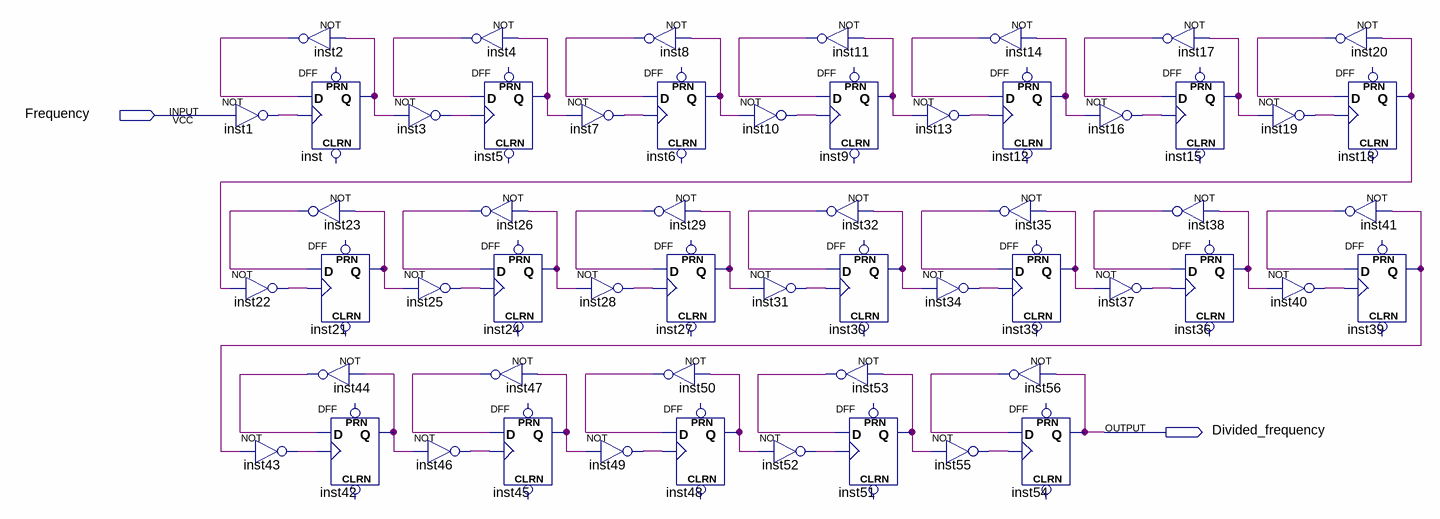
[diagram p0: schematic sheet]
// Quartus schematic Frequency_divider.bdf as structural Verilog: 57 symbols, 2 pins
module Frequency_divider (
  input  Frequency,
  output Divided_frequency
);

  wire inst1_out, inst2_out, inst3_out, inst4_out, inst5_q, inst6_q, inst7_out, inst8_out, inst9_q,
       inst10_out, inst11_out, inst12_q, inst13_out, inst14_out, inst15_q, inst16_out, inst17_out, inst18_q,
       inst19_out, inst20_out, inst21_q, inst22_out, inst23_out, inst24_q, inst25_out, inst26_out, inst27_q,
       inst28_out, inst29_out, inst30_q, inst31_out, inst32_out, inst33_q, inst34_out, inst35_out, inst36_q,
       inst37_out, inst38_out, inst39_q, inst40_out, inst41_out, inst42_q, inst43_out, inst44_out, inst45_q,
       inst46_out, inst47_out, inst48_q, inst49_out, inst50_out, inst51_q, inst52_out, inst53_out,
       inst55_out, inst56_out, inst_q;

  not inst1 (inst1_out, Frequency);
  not inst22 (inst22_out, inst18_q);
  not inst43 (inst43_out, inst39_q);
  not inst2 (inst2_out, inst_q);
  DFF inst (.CLK(inst1_out), .D(inst2_out), .Q(inst_q));  // open: CLRN, PRN
  not inst23 (inst23_out, inst21_q);
  DFF inst21 (.CLK(inst22_out), .D(inst23_out), .Q(inst21_q));  // open: CLRN, PRN
  not inst44 (inst44_out, inst42_q);
  DFF inst42 (.CLK(inst43_out), .D(inst44_out), .Q(inst42_q));  // open: CLRN, PRN
  not inst3 (inst3_out, inst_q);
  not inst25 (inst25_out, inst21_q);
  not inst46 (inst46_out, inst42_q);
  not inst4 (inst4_out, inst5_q);
  DFF inst5 (.CLK(inst3_out), .D(inst4_out), .Q(inst5_q));  // open: CLRN, PRN
  not inst26 (inst26_out, inst24_q);
  DFF inst24 (.CLK(inst25_out), .D(inst26_out), .Q(inst24_q));  // open: CLRN, PRN
  not inst47 (inst47_out, inst45_q);
  DFF inst45 (.CLK(inst46_out), .D(inst47_out), .Q(inst45_q));  // open: CLRN, PRN
  not inst7 (inst7_out, inst5_q);
  not inst8 (inst8_out, inst6_q);
  DFF inst6 (.CLK(inst7_out), .D(inst8_out), .Q(inst6_q));  // open: CLRN, PRN
  not inst29 (inst29_out, inst27_q);
  not inst28 (inst28_out, inst24_q);
  not inst49 (inst49_out, inst45_q);
  DFF inst27 (.CLK(inst28_out), .D(inst29_out), .Q(inst27_q));  // open: CLRN, PRN
  not inst50 (inst50_out, inst48_q);
  DFF inst48 (.CLK(inst49_out), .D(inst50_out), .Q(inst48_q));  // open: CLRN, PRN
  not inst10 (inst10_out, inst6_q);
  not inst31 (inst31_out, inst27_q);
  not inst52 (inst52_out, inst48_q);
  not inst11 (inst11_out, inst9_q);
  DFF inst9 (.CLK(inst10_out), .D(inst11_out), .Q(inst9_q));  // open: CLRN, PRN
  not inst32 (inst32_out, inst30_q);
  DFF inst30 (.CLK(inst31_out), .D(inst32_out), .Q(inst30_q));  // open: CLRN, PRN
  not inst53 (inst53_out, inst51_q);
  DFF inst51 (.CLK(inst52_out), .D(inst53_out), .Q(inst51_q));  // open: CLRN, PRN
  not inst13 (inst13_out, inst9_q);
  not inst34 (inst34_out, inst30_q);
  not inst55 (inst55_out, inst51_q);
  not inst14 (inst14_out, inst12_q);
  DFF inst12 (.CLK(inst13_out), .D(inst14_out), .Q(inst12_q));  // open: CLRN, PRN
  not inst35 (inst35_out, inst33_q);
  DFF inst33 (.CLK(inst34_out), .D(inst35_out), .Q(inst33_q));  // open: CLRN, PRN
  not inst56 (inst56_out, Divided_frequency);
  DFF inst54 (.CLK(inst55_out), .D(inst56_out), .Q(Divided_frequency));  // open: CLRN, PRN
  not inst16 (inst16_out, inst12_q);
  not inst37 (inst37_out, inst33_q);
  not inst17 (inst17_out, inst15_q);
  DFF inst15 (.CLK(inst16_out), .D(inst17_out), .Q(inst15_q));  // open: CLRN, PRN
  not inst38 (inst38_out, inst36_q);
  DFF inst36 (.CLK(inst37_out), .D(inst38_out), .Q(inst36_q));  // open: CLRN, PRN
  not inst19 (inst19_out, inst15_q);
  not inst20 (inst20_out, inst18_q);
  DFF inst18 (.CLK(inst19_out), .D(inst20_out), .Q(inst18_q));  // open: CLRN, PRN
  not inst41 (inst41_out, inst39_q);
  not inst40 (inst40_out, inst36_q);
  DFF inst39 (.CLK(inst40_out), .D(inst41_out), .Q(inst39_q));  // open: CLRN, PRN
endmodule
